# Altium schematic sheet 06_Input_Output.SchDoc: Input_Output
size A4; SheetNumber: 7; SheetTotal: 7; Project_Name: Monitoring_Control_Circuit; Version: 1.0
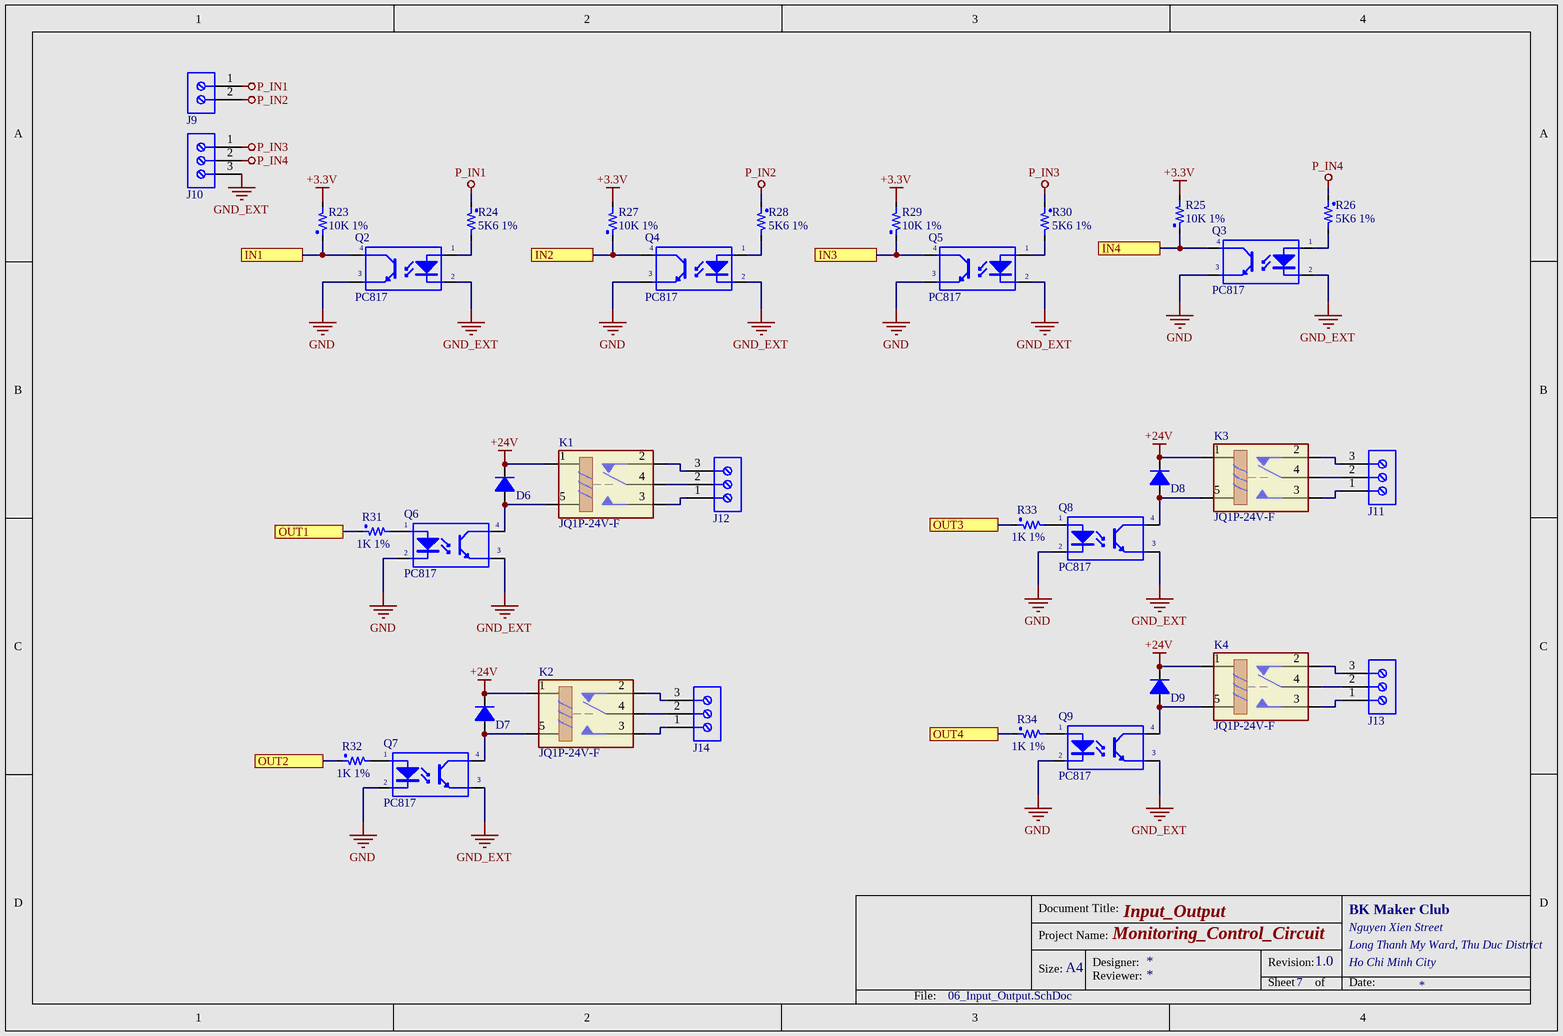
[diagram p0: 06_Input_Output.SchDoc]

## Parts
D6  S1M  [DO-214AC]  (value not drawn)
D7  S1M  [DO-214AC]  (value not drawn)
D8  S1M  [DO-214AC]  (value not drawn)
D9  S1M  [DO-214AC]  (value not drawn)
J9  691103110002  [691103110002]  (value not drawn)
J10  691103110003  [691103110003]  (value not drawn)
J11  691103110003  [691103110003]  (value not drawn)
J12  691103110003  [691103110003]  (value not drawn)
J13  691103110003  [691103110003]  (value not drawn)
J14  691103110003  [691103110003]  (value not drawn)
K1  JQ1P-24V-F  [JQ1P24VF]
K2  JQ1P-24V-F  [JQ1P24VF]
K3  JQ1P-24V-F  [JQ1P24VF]
K4  JQ1P-24V-F  [JQ1P24VF]
Q2  PC817  [SOP-4]
Q3  PC817  [SOP-4]
Q4  PC817  [SOP-4]
Q5  PC817  [SOP-4]
Q6  PC817  [SOP-4]
Q7  PC817  [SOP-4]
Q8  PC817  [SOP-4]
Q9  PC817  [SOP-4]
R23  10K 1%  [R0603 (1608 Metric)]
R24  5K6 1%  [R0603 (1608 Metric)]
R25  10K 1%  [R0603 (1608 Metric)]
R26  5K6 1%  [R0603 (1608 Metric)]
R27  10K 1%  [R0603 (1608 Metric)]
R28  5K6 1%  [R0603 (1608 Metric)]
R29  10K 1%  [R0603 (1608 Metric)]
R30  5K6 1%  [R0603 (1608 Metric)]
R31  1K 1%  [R0603 (1608 Metric)]
R32  1K 1%  [R0603 (1608 Metric)]
R33  1K 1%  [R0603 (1608 Metric)]
R34  1K 1%  [R0603 (1608 Metric)]

## Ports
IN1, IN2, IN3, IN4, OUT1, OUT2, OUT3, OUT4

## Nets
+3.3V: R23.2 R25.2 R27.2 R29.2
+24V: D6.2(K) D7.2(K) D8.2(K) D9.2(K) K1.1(COIL1) K2.1(COIL1) K3.1(COIL1) K4.1(COIL1)
GND: Q2.3(E) Q3.3(E) Q4.3(E) Q5.3(E) Q6.2(K) Q7.2(K) Q8.2(K) Q9.2(K)
GND_EXT: J10.3 Q2.2(K) Q3.2(K) Q4.2(K) Q5.2(K) Q6.3(E) Q7.3(E) Q8.3(E) Q9.3(E)
P_IN1: J9.1 R24.1
P_IN2: J9.2 R28.1
P_IN3: J10.1 R30.1
P_IN4: J10.2 R26.1
IN1: Q2.4(C) R23.1 ; port IN1
IN2: Q4.4(C) R27.1 ; port IN2
IN3: Q5.4(C) R29.1 ; port IN3
IN4: Q3.4(C) R25.1 ; port IN4
OUT1: R31.1 ; port OUT1
OUT2: R32.1 ; port OUT2
OUT3: R33.1 ; port OUT3
OUT4: R34.1 ; port OUT4
NetD6_1: D6.1(A) K1.5(COIL2) Q6.4(C)
NetD7_1: D7.1(A) K2.5(COIL2) Q7.4(C)
NetD8_1: D8.1(A) K3.5(COIL2) Q8.4(C)
NetD9_1: D9.1(A) K4.5(COIL2) Q9.4(C)
NetJ11_1: J11.1 K3.3(NO)
NetJ11_2: J11.2 K3.4(COM)
NetJ11_3: J11.3 K3.2(NC)
NetJ12_1: J12.1 K1.3(NO)
NetJ12_2: J12.2 K1.4(COM)
NetJ12_3: J12.3 K1.2(NC)
NetJ13_1: J13.1 K4.3(NO)
NetJ13_2: J13.2 K4.4(COM)
NetJ13_3: J13.3 K4.2(NC)
NetJ14_1: J14.1 K2.3(NO)
NetJ14_2: J14.2 K2.4(COM)
NetJ14_3: J14.3 K2.2(NC)
NetQ2_1: Q2.1(A) R24.2
NetQ3_1: Q3.1(A) R26.2
NetQ4_1: Q4.1(A) R28.2
NetQ5_1: Q5.1(A) R30.2
NetQ6_1: Q6.1(A) R31.2
NetQ7_1: Q7.1(A) R32.2
NetQ8_1: Q8.1(A) R33.2
NetQ9_1: Q9.1(A) R34.2

## Notes on the sheet
- Document Title:
- BK Maker Club
- Size:
- Project Name:
- A4
- Designer:
- Reviewer:
- Revision:
- Sheet
- of
- Nguyen Xien Street
- Long Thanh My Ward, Thu Duc District
- Ho Chi Minh City
- Date:
- File:

## Library data of the parts
D6-D9 = S1M: Rectifiers 1.0A 1000V; Mfr: ON Semiconductor / Fairchild; Forward Current: 1A; Mfr Part Number: S1M; Supplier Part Number 1: 512-S1M; Supplier 1: Mouser; Package: DO-214AC; Reverse Voltage: 1000V
J9 = 691103110002: WR-TBL Series 1031 Horizontal Entry Modular, THT, pitch 3.5mm, 2p; Mfr: Wurth Elektronik; Modularity: Yes; Rated Current: 10A; Working Voltage: 125V; ComponentLink1Description: Website Link; ComponentLink1URL: https://www.we-online.com/redexpert/article/691103110002?ad; ComponentLink2Description: Datasheet Link; ComponentLink2URL: https://www.we-online.com/redexpert/spec/691103110002?ad; Mfr Part Number: 691103110002; Category: Terminal Blocks; Match Code: WR-TBL; Mount: Through Hole; Operating Temperature Max: 105°C; Operating Temperature Min: -40°C; Packaging: Box; Application: Pressure Clamp; Number of Pins: 2; Number of Rows: 1; Orientation: Horizontal; Pitch: 3.5mm
J10-J14 = 691103110003: WR-TBL Series 1031 Horizontal Entry Modular, THT, pitch 3.5mm, 3p; Mfr: Wurth Elektronik; Modularity: Yes; Rated Current: 10A; Working Voltage: 125V; ComponentLink1Description: Website Link; ComponentLink1URL: https://www.we-online.com/redexpert/article/691103110003?ad; ComponentLink2Description: Datasheet Link; ComponentLink2URL: https://www.we-online.com/redexpert/spec/691103110003?ad; Mfr Part Number: 691103110003; Category: Terminal Blocks; Match Code: WR-TBL; Mount: Through Hole; Operating Temperature Max: 105°C; Operating Temperature Min: -40°C; Packaging: Box; Application: Pressure Clamp; Number of Pins: 3; Number of Rows: 1; Orientation: Horizontal; Pitch: 3.5mm
K1-K4 = JQ1P-24V-F: Relay or Contactor; Mfr: Panasonic; Datasheet Link: https://www3.panasonic.biz/ac/e_download/control/relay/power/catalog/mech_eng_jq.pdf; Height: 16mm; Mfr Part Number: JQ1P-24V-F; Supplier Part Number 1: 769-JQ1P-24V-F; Supplier 1: Mouser
Q2-Q9 = PC817XNNIP1B: Transistor Output Optocouplers Photocoupler; Mfr: Sharp Microelectronics; Value: PC817; Mfr Part Number: PC817XNNIP1B; Supplier 1: Mouser; Supplier Part Number 1: 852-PC817XNNIP1B; Parameter 5: *
R23 R25 R27 R29 = RC0603FR-0710KL: Thick Film Resistors - SMD 10K OHM 1% Case 0603; Mfr: Yageo; Value: 10K; Supplier 1: Mouser; Supplier Part Number 1: 603-RC0603FR-0710KL; Mfr Part Number: RC0603FR-0710KL; Case: 0603 (1608 metric); Tolerance: 1%
R24 R26 R28 R30 = RC0603FR-075K6L: Thick Film Resistors - SMD 5K6 OHM 1% Case 0603; Mfr: Yageo; Value: 5K6; Supplier 1: Mouser; Supplier Part Number 1: 603-RC0603FR-075K6L; Mfr Part Number: RC0603FR-075K6L; Case: 0603 (1608 metric); Tolerance: 1%
R31-R34 = RC0603FR-071KL: Thick Film Resistors - SMD 1K OHM 1% Case 0603; Mfr: Yageo; Value: 1K; Supplier 1: Mouser; Supplier Part Number 1: 603-RC0603FR-071KL; Mfr Part Number: RC0603FR-071KL; Case: 0603 (1608 metric); Tolerance: 1%